# EAGLE design Hardware_X_Paper (EAGLE 9.3.0)

## Sheet 1 of 2
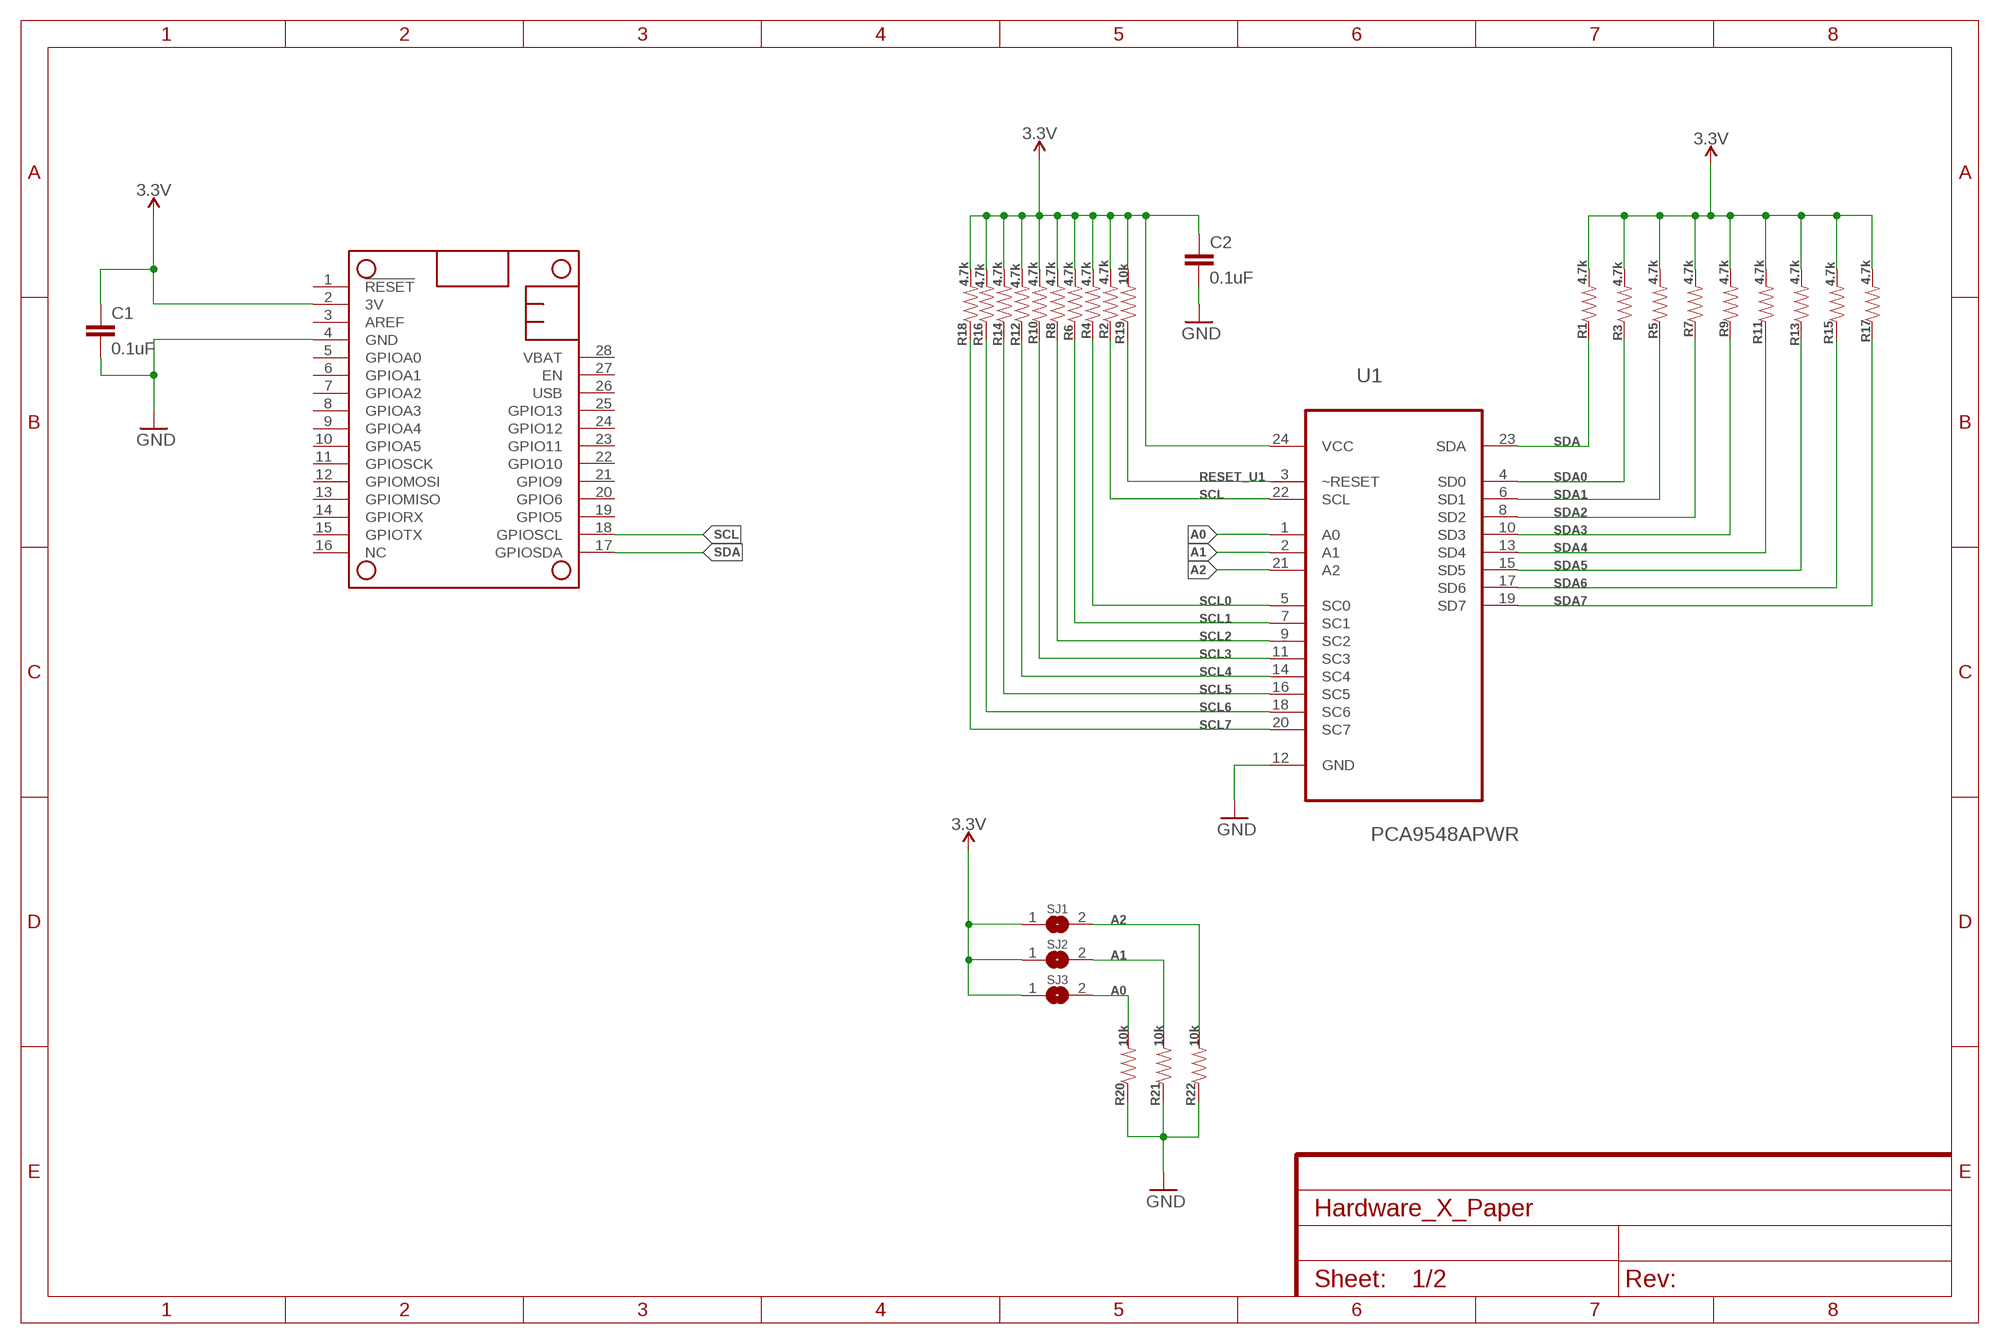
[diagram p0: schematic, sheet 1]

### Parts
C1  0.1uF  0.1UF-0603-25V-(+80/-20%)  [0603]
C2  0.1uF  0.1UF-0603-25V-(+80/-20%)  [0603]
MS1  MICROBUILDER_FEATHERWING_NOHOLES  [MICROBUILDER_FEATHERWING_NOHOLES]
R1  4.7k  4.7KOHM-0603-1/10W-1%  [0603]
R2  4.7k  4.7KOHM-0603-1/10W-1%  [0603]
R3  4.7k  4.7KOHM-0603-1/10W-1%  [0603]
R4  4.7k  4.7KOHM-0603-1/10W-1%  [0603]
R5  4.7k  4.7KOHM-0603-1/10W-1%  [0603]
R6  4.7k  4.7KOHM-0603-1/10W-1%  [0603]
R7  4.7k  4.7KOHM-0603-1/10W-1%  [0603]
R8  4.7k  4.7KOHM-0603-1/10W-1%  [0603]
R9  4.7k  4.7KOHM-0603-1/10W-1%  [0603]
R10  4.7k  4.7KOHM-0603-1/10W-1%  [0603]
R11  4.7k  4.7KOHM-0603-1/10W-1%  [0603]
R12  4.7k  4.7KOHM-0603-1/10W-1%  [0603]
R13  4.7k  4.7KOHM-0603-1/10W-1%  [0603]
R14  4.7k  4.7KOHM-0603-1/10W-1%  [0603]
R15  4.7k  4.7KOHM-0603-1/10W-1%  [0603]
R16  4.7k  4.7KOHM-0603-1/10W-1%  [0603]
R17  4.7k  4.7KOHM-0603-1/10W-1%  [0603]
R18  4.7k  4.7KOHM-0603-1/10W-1%  [0603]
R19  10k  10KOHM-0603-1/10W-1%  [0603]
R20  10k  10KOHM-0603-1/10W-1%  [0603]
R21  10k  10KOHM-0603-1/10W-1%  [0603]
R22  10k  10KOHM-0603-1/10W-1%  [0603]
SJ1  MICROBUILDER_SOLDERJUMPER  [MICROBUILDER_SOLDERJUMPER_ARROW_NOPASTE]
SJ2  MICROBUILDER_SOLDERJUMPER  [MICROBUILDER_SOLDERJUMPER_ARROW_NOPASTE]
SJ3  MICROBUILDER_SOLDERJUMPER  [MICROBUILDER_SOLDERJUMPER_ARROW_NOPASTE]
U1  PCA9548APWR  [SOP65P640X120-24N]

### Nets
3.3V: C1.1 C2.1 MS1.2(3V) R1.2 R2.2 R3.2 R4.2 R5.2 R6.2 R7.2 R8.2 R9.2 R10.2 R11.2 R12.2 R13.2 R14.2 R15.2 R16.2 R17.2 R18.2 R19.2 SJ1.1 SJ2.1 SJ3.1 U1.24(VCC) ; also sheet 2
A0: R20.2 SJ3.2 U1.1(A0)
A1: R21.2 SJ2.2 U1.2(A1)
A2: R22.2 SJ1.2 U1.21(A2)
GND: C1.2 C2.2 MS1.4(GND) R20.1 R21.1 R22.1 U1.12(GND) ; also sheet 2
RESET_U1: R19.1 U1.3(~RESET)
SCL: MS1.18(GPIOSCL) R2.1 U1.22(SCL)
SCL0: R4.1 U1.5(SC0) ; also sheet 2
SCL1: R6.1 U1.7(SC1) ; also sheet 2
SCL2: R8.1 U1.9(SC2) ; also sheet 2
SCL3: R10.1 U1.11(SC3) ; also sheet 2
SCL4: R12.1 U1.14(SC4) ; also sheet 2
SCL5: R14.1 U1.16(SC5) ; also sheet 2
SCL6: R16.1 U1.18(SC6) ; also sheet 2
SCL7: R18.1 U1.20(SC7) ; also sheet 2
SDA: MS1.17(GPIOSDA) R1.1 U1.23(SDA)
SDA0: R3.1 U1.4(SD0) ; also sheet 2
SDA1: R5.1 U1.6(SD1) ; also sheet 2
SDA2: R7.1 U1.8(SD2) ; also sheet 2
SDA3: R9.1 U1.10(SD3) ; also sheet 2
SDA4: R11.1 U1.13(SD4) ; also sheet 2
SDA5: R13.1 U1.15(SD5) ; also sheet 2
SDA6: R15.1 U1.17(SD6) ; also sheet 2
SDA7: R17.1 U1.19(SD7) ; also sheet 2
Unconnected: MS1.1(!RESET) MS1.3(AREF) MS1.5(GPIOA0) MS1.6(GPIOA1) MS1.7(GPIOA2) MS1.8(GPIOA3) MS1.9(GPIOA4) MS1.10(GPIOA5) MS1.11(GPIOSCK) MS1.12(GPIOMOSI) MS1.13(GPIOMISO) MS1.14(GPIORX) MS1.15(GPIOTX) MS1.16(NC) MS1.19(GPIO5) MS1.20(GPIO6) MS1.21(GPIO9) MS1.22(GPIO10) MS1.23(GPIO11) MS1.24(GPIO12) MS1.25(GPIO13) MS1.26(USB) MS1.27(EN) MS1.28(VBAT)

## Sheet 2 of 2
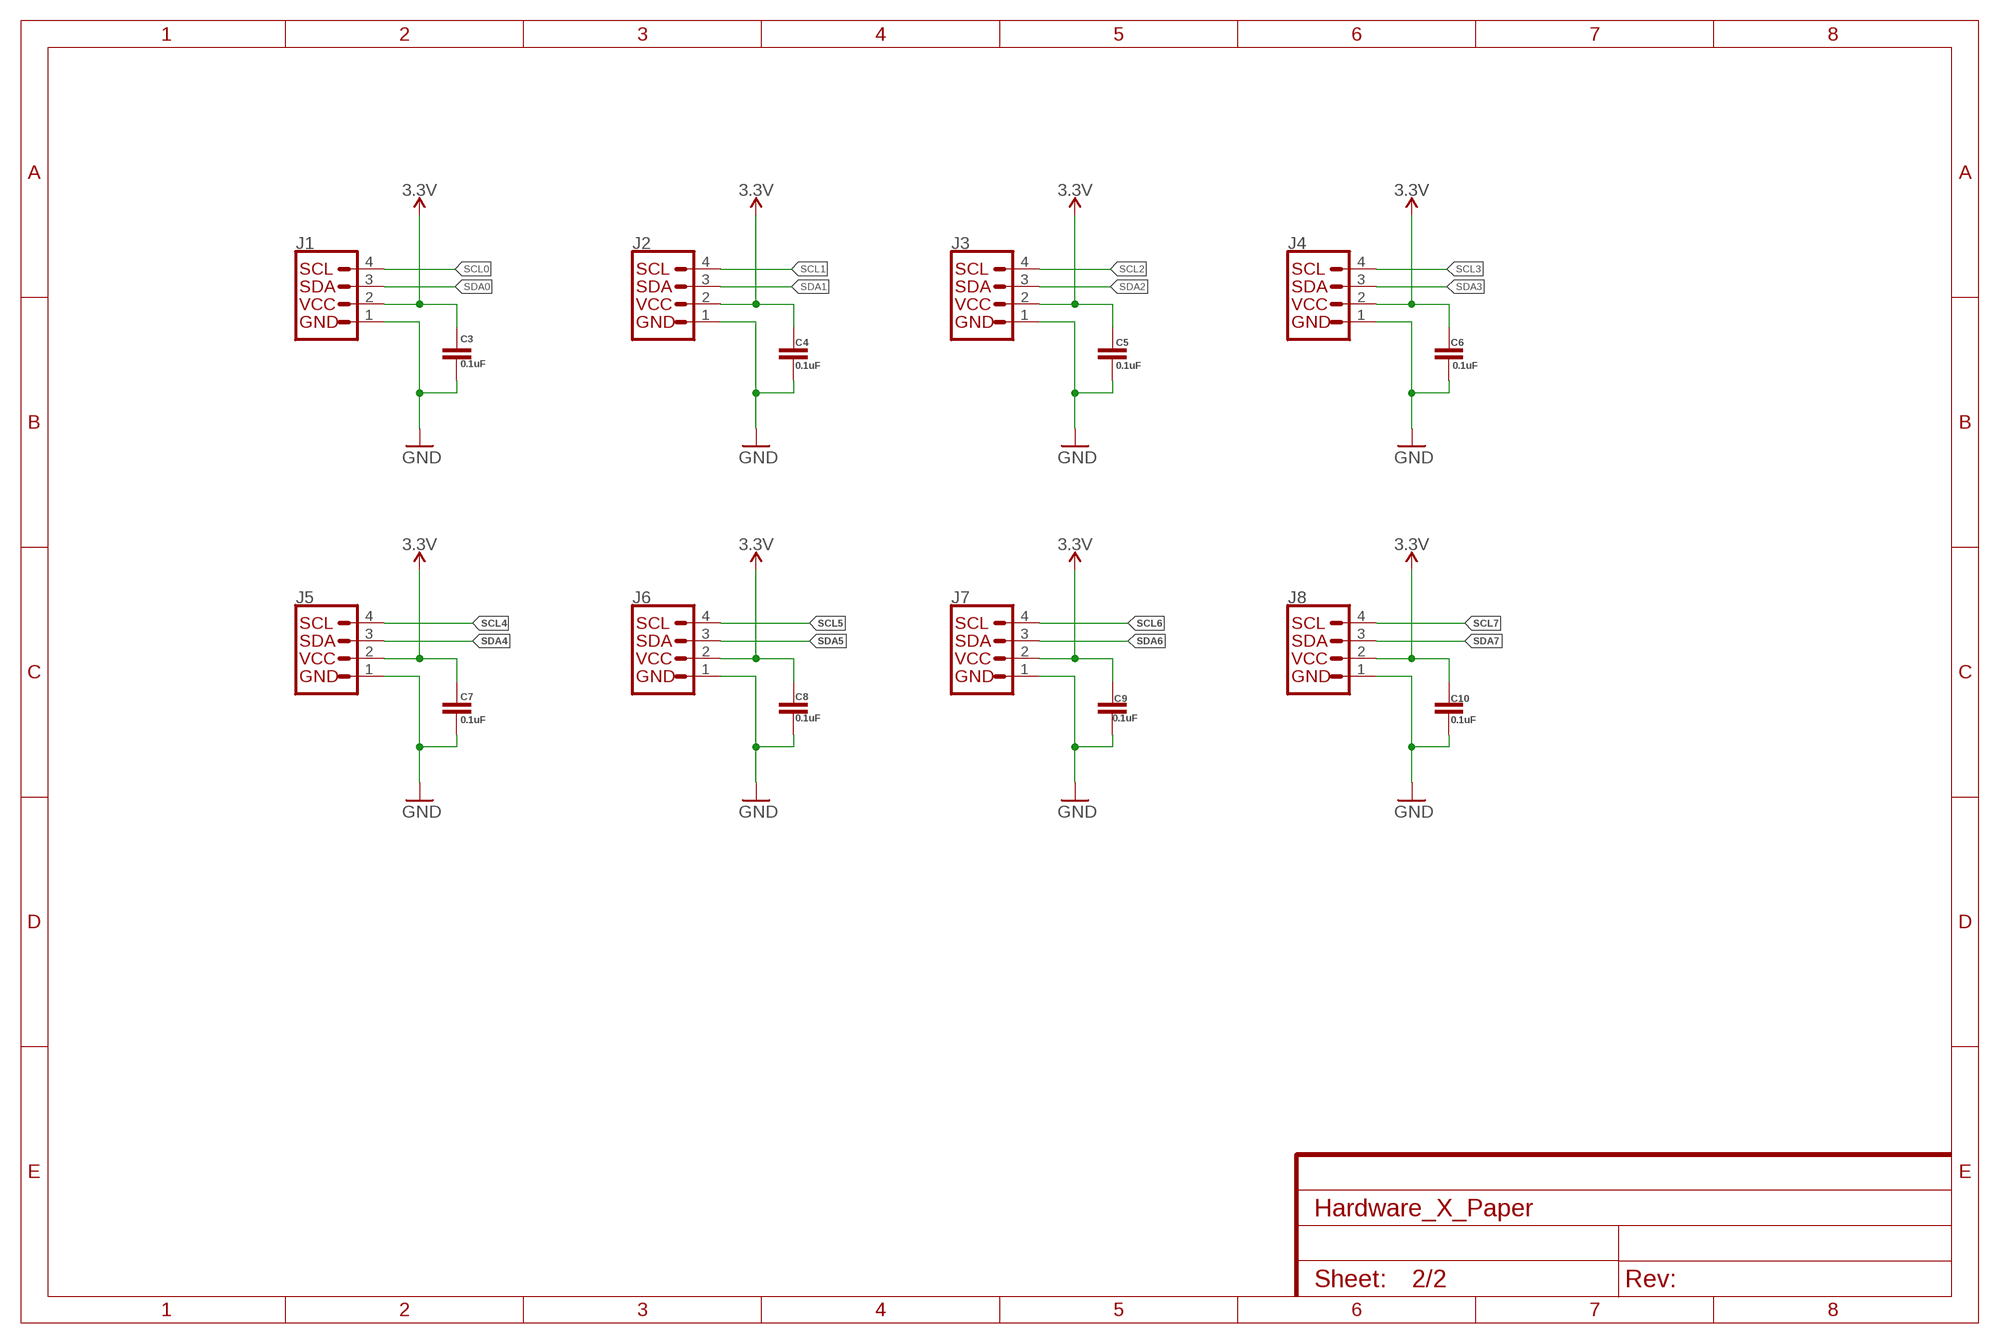
[diagram p1: schematic, sheet 2]

### Parts
C3  0.1uF  0.1UF-0603-25V-(+80/-20%)  [0603]
C4  0.1uF  0.1UF-0603-25V-(+80/-20%)  [0603]
C5  0.1uF  0.1UF-0603-25V-(+80/-20%)  [0603]
C6  0.1uF  0.1UF-0603-25V-(+80/-20%)  [0603]
C7  0.1uF  0.1UF-0603-25V-(+80/-20%)  [0603]
C8  0.1uF  0.1UF-0603-25V-(+80/-20%)  [0603]
C9  0.1uF  0.1UF-0603-25V-(+80/-20%)  [0603]
C10  0.1uF  0.1UF-0603-25V-(+80/-20%)  [0603]
J1  QWIIC_CONNECTORJS-1MM  [1X04_1MM_RA]
J2  QWIIC_CONNECTORJS-1MM  [1X04_1MM_RA]
J3  QWIIC_CONNECTORJS-1MM  [1X04_1MM_RA]
J4  QWIIC_CONNECTORJS-1MM  [1X04_1MM_RA]
J5  QWIIC_CONNECTORJS-1MM  [1X04_1MM_RA]
J6  QWIIC_CONNECTORJS-1MM  [1X04_1MM_RA]
J7  QWIIC_CONNECTORJS-1MM  [1X04_1MM_RA]
J8  QWIIC_CONNECTORJS-1MM  [1X04_1MM_RA]

### Nets
3.3V: C3.1 C4.1 C5.1 C6.1 C7.1 C8.1 C9.1 C10.1 J1.2(VCC) J2.2(VCC) J3.2(VCC) J4.2(VCC) J5.2(VCC) J6.2(VCC) J7.2(VCC) J8.2(VCC) ; also sheet 1
GND: C3.2 C4.2 C5.2 C6.2 C7.2 C8.2 C9.2 C10.2 J1.1(GND) J2.1(GND) J3.1(GND) J4.1(GND) J5.1(GND) J6.1(GND) J7.1(GND) J8.1(GND) ; also sheet 1
SCL0: J1.4(SCL) ; also sheet 1
SCL1: J2.4(SCL) ; also sheet 1
SCL2: J3.4(SCL) ; also sheet 1
SCL3: J4.4(SCL) ; also sheet 1
SCL4: J5.4(SCL) ; also sheet 1
SCL5: J6.4(SCL) ; also sheet 1
SCL6: J7.4(SCL) ; also sheet 1
SCL7: J8.4(SCL) ; also sheet 1
SDA0: J1.3(SDA) ; also sheet 1
SDA1: J2.3(SDA) ; also sheet 1
SDA2: J3.3(SDA) ; also sheet 1
SDA3: J4.3(SDA) ; also sheet 1
SDA4: J5.3(SDA) ; also sheet 1
SDA5: J6.3(SDA) ; also sheet 1
SDA6: J7.3(SDA) ; also sheet 1
SDA7: J8.3(SDA) ; also sheet 1

## Library data of the parts
C1-C10 = SparkFun-Capacitors:0.1UF: 0.1µF ceramic capacitors A capacitor is a passive two-terminal electrical component used to store electrical energy temporarily in an electric field.; PROD_ID: CAP-00810
J1-J8 = SparkFun-Connectors:QWIIC_CONNECTOR: SparkFun I2C Standard Qwiic Connector An SMD 1mm pitch JST connector makes it easy and quick (get it? Qwiic?) to connect I2C devices to each other. The Qwiic system <http://www.sparkfun.com/qwiic> enables fast and solderless connection between popular platforms and various sensors and actuators. We carry 200mm <https://www.sparkfun.com/products/14204>, 100mm <https://www.sparkfun.com/products/14205>, 50mm <https://www.sparkfun.com/products/14206>, and breadboard friendly <https://www.sparkfun.com/products/14207> Qwiic cables. We also offer 10 pcs strips <https://www.sparkfun.com/products/14323> the SMD connectors.
MS1 = Adafruit Crickit FeatherWing:MICROBUILDER_FEATHERWING
R1-R18 = SparkFun-Resistors:4.7KOHM: 4.7kΩ resistor A resistor is a passive two-terminal electrical component that implements electrical resistance as a circuit element. Resistors act to reduce current flow, and, at the same time, act to lower voltage levels within circuits. - Wikipedia; PROD_ID: RES-07857
R19-R22 = SparkFun-Resistors:10KOHM: 10kΩ resistor A resistor is a passive two-terminal electrical component that implements electrical resistance as a circuit element. Resistors act to reduce current flow, and, at the same time, act to lower voltage levels within circuits. - Wikipedia; PROD_ID: RES-00824
SJ1-SJ3 = Adafruit Crickit FeatherWing:MICROBUILDER_SOLDERJUMPER: SMD Solder JUMPER Solder the two pads together to create a connection, or remove the solder to break it. REFLOW - Use this footprint for solder paste and reflow ovens. WAVE - Use this footprint for hand-soldering (larger pads). CLOSED - Has a trace between the two pads to ensure it is closed by default. The trace needs to be cut to disable the jumper, and can be closed again by creating a solder bridge between the two pads.; BOM: EXCLUDE
U1 = PCA9548APWR:PCA9548APWR: 8-CHANNEL I2C SWITCH WITH RESET; AVAILABILITY: Unavailable; DESCRIPTION: 8-Channel I2C Switch With Reset 24-TSSOP -40 to 85; MF: Texas Instruments; MP: PCA9548APWR; PACKAGE: TSSOP-24 Texas Instruments; PRICE: None

## Board
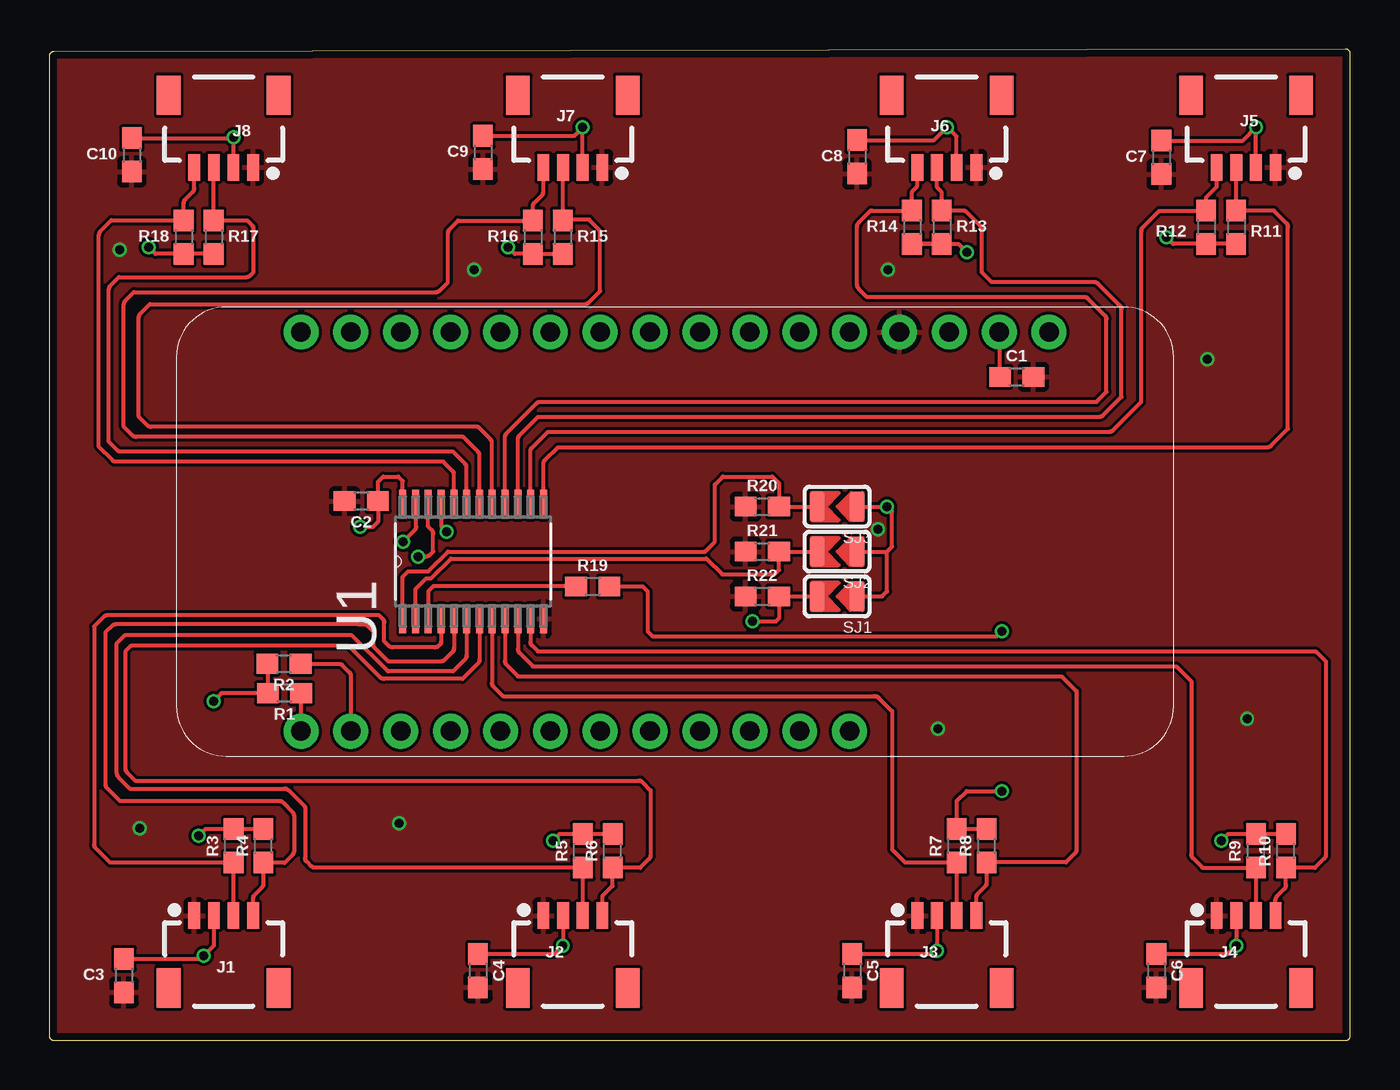
[diagram p2: board, top side]
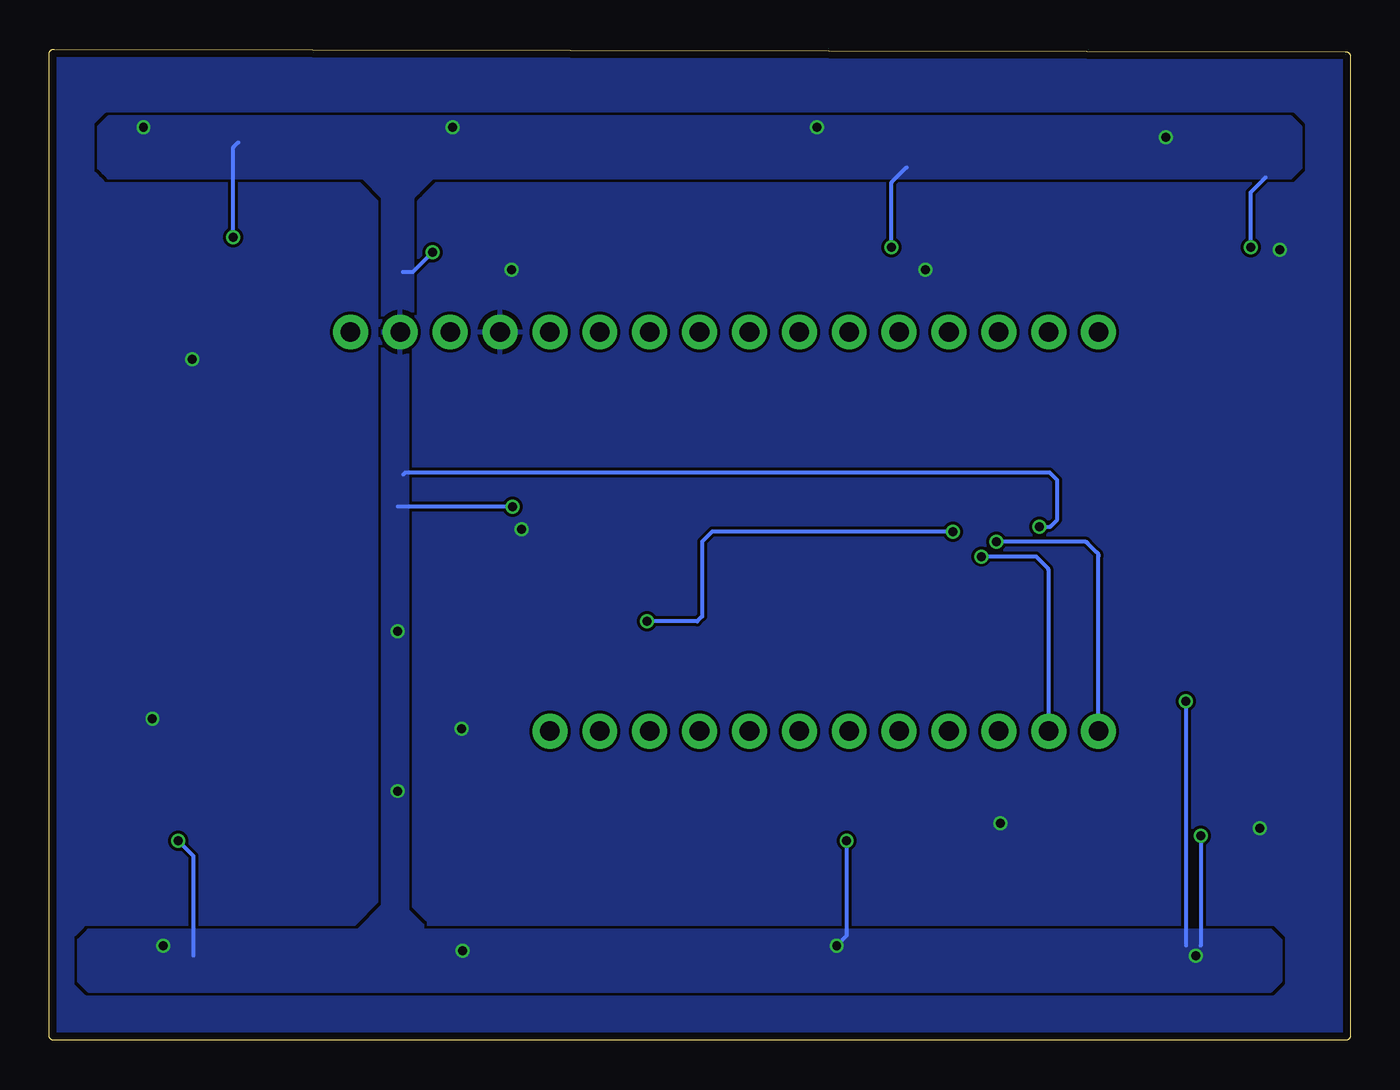
[diagram p3: board, bottom side, seen from below]

Size 66.27 x 50.47 mm. Coordinates in mm from the lower left corner, seen from the top.
Outline: 66.27,0.25 66.27,50.22 arc90 66.02,50.47 0.25,50.34 arc90 0,50.09 0,0.25 arc90 0.25,0 66.02,0 arc90 66.27,0.25
Copper layers (1*16): Top 0.035559375mm / dielectric 1.6mm / Bottom 0.035559375mm
Design rules "oshpark-2layer": minimum track width 6mil, minimum drill 10mil, track to track 6mil, track to pad 6mil, pad to pad 6mil, via to via 6mil, smd to smd 6mil, copper to edge 15mil, drill to drill 6mil, minimum pad ring 5mil, minimum via ring 5mil, stop-mask expansion 2.5mil, vias tented up to drill 0mil, thermal gap 10mil

### Footprints (pad centres in the part's own frame; a part is rotated, then mirrored left to right if it is on the bottom)
0603 = smd 1.1 x 1: 1 -0.85,0; 2 0.85,0
1X04_1MM_RA = smd 0.6 x 1.35: 1 -1.5,0; 2 -0.5,0; 3 0.5,0; 4 1.5,0 | smd 1.2 x 2: NC1 2.8,-3.675; NC2 -2.8,-3.675
MICROBUILDER_FEATHERWING_NOHOLES = drill 1 pad 1.778: 1 6.35,1.27; 2 8.89,1.27; 3 11.43,1.27; 4 13.97,1.27; 5 16.51,1.27; 6 19.05,1.27; 7 21.59,1.27; 8 24.13,1.27; 9 26.67,1.27; 10 29.21,1.27; 11 31.75,1.27; 12 34.29,1.27; 13 36.83,1.27; 14 39.37,1.27; 15 41.91,1.27; 16 44.45,1.27; 17 44.45,21.59; 18 41.91,21.59; 19 39.37,21.59; 20 36.83,21.59; 21 34.29,21.59; 22 31.75,21.59; 23 29.21,21.59; 24 26.67,21.59; 25 24.13,21.59; 26 21.59,21.59; 27 19.05,21.59; 28 16.51,21.59
MICROBUILDER_SOLDERJUMPER_ARROW_NOPASTE = smd 0.762 x 1.524: 1 -1.016,0; 2 1.016,0
SOP65P640X120-24N = smd 1.473 x 0.356: 1 -2.921,3.581; 2 -2.921,2.921; 3 -2.921,2.286; 4 -2.921,1.626; 5 -2.921,0.965; 6 -2.921,0.33; 7 -2.921,-0.33; 8 -2.921,-0.965; 9 -2.921,-1.626; 10 -2.921,-2.286; 11 -2.921,-2.921; 12 -2.921,-3.581; 13 2.921,-3.581; 14 2.921,-2.921; 15 2.921,-2.286; 16 2.921,-1.626; 17 2.921,-0.965; 18 2.921,-0.33; 19 2.921,0.33; 20 2.921,0.965; 21 2.921,1.626; 22 2.921,2.286; 23 2.921,2.921; 24 2.921,3.581

### Placement (x,y rotation side)
C1  49.28,33.78 0 top
C2  15.9,27.46 180 top
C3  3.81,3.3 270 top
C4  21.84,3.56 270 top
C5  40.89,3.56 270 top
C6  56.39,3.56 270 top
C7  56.64,44.96 270 top
C8  41.15,44.98 270 top
C9  22.1,45.21 270 top
C10  4.22,45.09 270 top
J1  8.89,6.35 0 top
J2  26.67,6.35 0 top
J3  45.72,6.35 0 top
J4  60.96,6.35 0 top
J5  60.96,44.45 180 top
J6  45.72,44.45 180 top
J7  26.67,44.45 180 top
J8  8.89,44.45 180 top
MS1  57.28,37.34 180 top
R1  11.99,17.68 180 top
R2  11.96,19.18 180 top
R3  9.4,9.91 90 top
R4  10.92,9.91 90 top
R5  27.18,9.65 90 top
R6  28.7,9.65 90 top
R7  46.23,9.91 90 top
R8  47.75,9.91 90 top
R9  61.47,9.65 90 top
R10  62.99,9.65 90 top
R11  60.45,41.4 270 top
R12  58.93,41.4 270 top
R13  45.47,41.4 270 top
R14  43.94,41.4 270 top
R15  26.16,40.89 270 top
R16  24.64,40.89 270 top
R17  8.38,40.89 270 top
R18  6.86,40.89 270 top
R19  27.69,23.11 0 top
R20  36.32,27.18 0 top
R21  36.32,24.89 0 top
R22  36.32,22.61 0 top
SJ1  40.13,22.61 180 top
SJ2  40.13,24.89 180 top
SJ3  40.13,27.18 180 top
U1  21.59,24.38 90 top

### Tracks (layer width: path | path; a pad name or v marks a point on that pad's centre or on a via)
3.3V  (via drill 0.46)
  Top 0.203: C1.1 48.43,36.03 MS1.2 | J8.2 9.39,45.92 | 9.39,45.92 v9.39,45.97 v9.4,45.97 9.65,45.97 | C10.1 9.38,45.94 9.39,45.92 | C9.1 26.76,46.06 v27.18,46.48 v27.17,46.47 J7.2 | J6.2 46.22,46.03 45.77,46.48 v45.72,46.48 45.07,45.83 C8.1 | C7.1 60.79,45.81 v61.47,46.48 v61.46,46.47 J5.2 | R13.2 R14.2 46.32,40.55 v46.74,40.13 | R15.2 R16.2 23.71,40.04 v23.37,40.39 | J1.2 8.39,4.83 v7.87,4.32 7.71,4.15 C3.1 | C4.1 25.74,4.41 v26.16,4.83 v26.17,4.83 J2.2 | C5.1 45.05,4.41 v45.21,4.57 v45.22,4.58 J3.2 | R8.2 R7.2 46.23,12.19 46.74,12.7 v48.51,12.7 | C6.1 60.03,4.41 v60.45,4.83 v60.46,4.83 J4.2 | R10.2 R9.2 60.03,10.5 v59.69,10.16 | SJ3.1 v42.67,27.18 42.93,26.92 42.93,25.15 42.67,24.89 | R17.2 R18.2 5.42,40.04 v5.08,40.39 | SJ2.1 42.67,24.89 | SJ1.1 42.42,22.61 42.67,22.86 42.67,24.89 | U1.24 18.01,28.47 17.78,28.7 17.02,28.7 16.75,28.43 C2.1 16.75,26.4 16.48,26.14 15.88,26.14 v15.85,26.16 | R4.2 R3.2 7.96,10.76 v7.62,10.41 | R2.2 11.14,19.15 R1.2 8.79,17.68 v8.38,17.27 | R6.2 R5.2 26,10.5 v25.65,10.16 | R19.2 30.23,23.11 30.48,22.86 30.48,20.83 30.73,20.57 48.26,20.57 v48.51,20.83 | R11.2 R12.2 57.24,40.55 v56.9,40.89
  Bottom 0.203: v46.74,40.13 47.75,39.12 48.26,39.12 | v23.37,40.39 23.37,43.69 22.61,44.45 | v59.69,10.16 58.93,9.4 58.93,4.32 | v42.67,27.18 48.51,27.18 | v15.85,26.16 15.29,26.16 14.94,26.52 14.94,28.52 15.32,28.91 48.13,28.91 48.23,28.8 | v7.62,10.41 7.62,4.83 | v8.38,17.27 8.38,4.83 | v25.65,10.16 25.65,5.33 v26.16,4.83 | v5.08,40.39 5.08,43.18 4.32,43.94 | v56.9,40.89 56.9,45.47 56.64,45.72
  pour Bottom: 3.05,46.99 63.25,46.99 63.75,46.48 63.75,45.47 63.75,44.45 63.5,44.2 63.25,43.94 60.71,43.94 3.05,43.94 2.79,44.2 2.54,44.45 2.54,45.21 2.54,46.48
  pour Bottom: 4.06,5.59 64.26,5.59 64.77,5.08 64.77,4.06 64.77,3.05 64.52,2.79 64.26,2.54 61.72,2.54 4.06,2.54 3.81,2.79 3.56,3.05 3.56,3.81 3.56,5.08
  pour Bottom: 47.75,36.07 47.75,42.93 47.5,43.18 46.48,44.2 46.48,44.7 46.48,44.96 46.99,45.47 47.24,45.72 49.28,45.72 49.78,45.21 50.29,44.7 50.29,43.94 49.28,42.93 49.28,36.32 49.28,6.86 50.55,5.59 50.55,4.83 50.55,4.57 50.04,4.06 48.26,4.06 47.75,4.06 47.24,4.57 47.24,5.84 48.01,6.6 48.01,35.81
A0
  Top 0.203: SJ3.2 R20.2 37.17,28.36 36.83,28.7 34.31,28.7 33.91,28.3 33.91,25.4 33.4,24.89 20.32,24.89 19.3,23.88 18.29,23.88 18.01,23.6 U1.1
A1
  Top 0.203: SJ2.2 R21.2 37.17,23.96 36.93,23.72 34.29,23.72 33.48,24.54 20.47,24.54 19.45,23.52 19.2,23.52 18.67,22.99 U1.2
A2  (via drill 0.46)
  Top 0.203: SJ1.2 R22.2 37.19,22.59 37.19,21.51 37.01,21.34 v35.81,21.34 | U1.21 19.96,26.19 v20.24,25.91
  Bottom 0.203: v20.24,25.91 32.51,25.91 33.02,25.4 33.02,21.59 33.27,21.34 v35.81,21.34
GND  (via drill 0.46)
  other vias: 42.21,26.04 4.62,10.79 17.83,11.05 45.26,15.88 61.01,16.38 58.98,34.67 42.72,39.24 21.64,39.24 3.61,40.26
  pour Top (rank 6): 0,-0.25 66.04,-0.25 arc90 66.29,0 66.29,50.29 0.25,50.29 arc90 0,50.04
  pour Bottom (rank 6): 0,0 66.04,0 arc90 66.29,0.25 66.29,50.29 0.25,50.29 arc90 0,50.04
RESET_U1
  Top 0.203: U1.3 19.3,22.86 19.56,23.11 R19.1
SCL  (via drill 0.46)
  Top 0.203: R2.1 14.75,19.18 arc-45 14.93,19.1 15.29,18.74 arc-45 15.37,18.56 MS1.18 | v18.8,24.64 19.2,24.64 arc45 19.38,24.71 19.56,24.89 19.56,25.8 arc45 19.48,25.98 19.3,26.16 U1.22
  Bottom 0.203: MS1.18 15.37,23.9 arc-45 15.44,24.08 16,24.64 v18.8,24.64
SCL0
  Top 0.203: J1.4 10.39,7.24 arc-45 10.46,7.42 10.85,7.8 arc45 10.92,7.98 R4.1 arc45 10.96,9.04 11.99,9.04 12.4,9.45 arc45 12.47,9.63 12.47,11.45 arc45 12.4,11.63 11.91,12.12 arc45 11.73,12.19 3.61,12.19 2.94,12.85 arc-45 2.87,13.03 2.87,20.78 3.2,21.11 arc-45 3.38,21.18 15.75,21.18 15.79,21.18 16.05,21.18 arc-45 16.23,21.11 16.51,20.83 16.51,20.07 17.27,19.3 19.96,19.3 arc45 20.14,19.38 20.55,19.79 arc45 20.62,19.97 U1.5
SCL1
  Top 0.203: J2.4 arc45 28.19,6.41 28.19,7.37 28.7,7.87 28.7,8.76 | 28.7,8.76 R6.1 | U1.7 21.92,19.38 arc-45 21.85,19.2 21.06,18.41 17.05,18.41 arc-45 16.87,18.49 15.27,20.09 4.17,20.09 3.89,19.81 3.89,13.85 arc45 3.96,13.67 4.39,13.23 30.02,13.23 arc-45 30.2,13.16 30.63,12.72 30.63,9.43 arc-45 30.56,9.25 30.1,8.79 28.76,8.79 arc45 28.7,8.76
SCL2
  Top 0.203: J3.4 47.22,7.29 arc-45 47.29,7.47 47.68,7.85 arc45 47.75,8.03 R8.1 arc-45 47.78,9.07 51.79,9.07 52.25,9.53 arc45 52.32,9.71 52.32,17.78 51.64,18.47 arc45 51.46,18.54 23.88,18.54 23.29,19.13 arc-45 23.22,19.31 U1.9
SCL3
  Top 0.203: U1.11 24.51,20.3 arc45 24.59,20.12 24.89,19.81 64.41,19.81 arc-45 64.59,19.74 65.02,19.3 65.02,9.45 arc-45 64.95,9.27 64.47,8.79 63.02,8.79 arc-45 R10.1 62.99,7.9 arc-45 62.92,7.72 62.53,7.34 arc45 62.46,7.16 J4.4
SCL4
  Top 0.203: U1.14 24.51,29.99 arc-45 24.59,30.17 25.4,30.99 54,30.99 arc45 54.18,31.06 55.63,32.51 55.63,41.22 arc-45 55.7,41.4 56.54,42.24 58.9,42.24 arc45 R12.1 58.93,42.93 59.46,43.46 J5.4
SCL5
  Top 0.203: U1.16 23.22,30.73 arc-45 23.29,30.91 24.82,32.44 arc-45 25,32.51 53.34,32.51 53.85,33.02 53.85,36.73 arc45 53.77,36.9 52.91,37.77 arc45 52.73,37.85 41.66,37.85 41.22,38.28 arc-45 41.15,38.46 41.15,41.45 arc-45 41.22,41.63 41.81,42.22 arc-45 41.89,42.25 R14.1 43.94,43.17 arc-45 43.97,43.23 44.15,43.41 arc45 44.22,43.59 J6.4
SCL6
  Top 0.203: U1.18 21.92,29.79 arc45 21.85,29.97 21.08,30.73 4.42,30.73 arc-45 4.24,30.81 3.81,31.24 3.81,37.49 arc-45 3.88,37.67 4.32,38.1 19.71,38.1 arc45 19.89,38.17 20.32,38.61 20.32,41.12 arc-45 20.39,41.3 20.83,41.73 24.61,41.73 arc45 R16.1 24.64,42.47 arc-45 24.71,42.65 25.1,43.03 arc45 25.17,43.21 J7.4
SCL7
  Top 0.203: U1.20 20.62,28.8 arc45 20.55,28.98 20.07,29.46 3.41,29.46 arc-45 3.23,29.54 2.54,30.23 2.54,41.02 arc-45 2.61,41.2 3.17,41.76 6.83,41.76 arc-45 R18.1 6.86,42.64 arc-45 6.93,42.82 7.32,43.21 arc45 7.39,43.38 J8.4
SDA  (via drill 0.46)
  Top 0.152: 12.83,17.67 arc-90 R1.1
  Top 0.203: MS1.17 12.83,17.67 | U1.23 arc-45 18.69,27.24 18.69,26.17 arc-45 18.62,25.99 v18.03,25.4
  Bottom 0.203: MS1.17 12.83,24.66 arc-45 12.9,24.84 13.39,25.33 arc-45 13.57,25.4 v18.03,25.4
SDA0
  Top 0.203: J1.3 arc45 9.4,6.37 R3.1 arc45 9.37,9.07 3.1,9.07 2.36,9.81 arc-45 2.29,9.99 2.29,21.08 2.77,21.57 arc-45 2.95,21.64 16.82,21.64 16.99,21.46 arc-45 17.07,21.28 17.07,20.32 17.3,20.09 arc45 17.48,20.02 19.66,20.02 arc45 19.84,20.09 19.91,20.17 arc45 19.96,20.29 U1.4
SDA1
  Top 0.203: U1.6 21.26,19.59 arc-45 21.18,19.41 20.57,18.8 17.27,18.8 arc-45 17.23,18.81 15.42,20.62 3.86,20.62 3.43,20.19 3.43,13.62 3.45,13.59 arc45 3.53,13.41 4.12,12.83 11.98,12.83 arc-45 12.16,12.75 13.03,11.89 13.03,9.3 arc45 13.11,9.12 13.35,8.88 arc45 13.53,8.8 R5.1 | 26.93,8.66 arc45 27.11,8.74 R5.1 | R5.1 arc45 27.17,8.78 J2.3
SDA2
  Top 0.203: J3.3 arc45 46.23,6.37 R7.1 arc45 46.2,9.07 43.59,9.07 43,9.65 arc-45 42.93,9.83 42.93,16.76 42.24,17.45 arc45 42.06,17.53 23.11,17.53 22.63,18.01 arc-45 22.55,18.19 U1.8
SDA3
  Top 0.203: U1.10 23.88,19.92 arc45 23.95,19.74 24.64,19.05 57.3,19.05 arc-45 57.48,18.98 58.17,18.29 58.17,9.48 arc45 58.24,9.3 58.73,8.81 arc45 58.75,8.8 R9.1 61.47,6.37 arc-45 J4.3
SDA4
  Top 0.203: U1.13 25.17,29.36 arc-45 25.25,29.54 25.91,30.2 62.05,30.2 arc45 62.23,30.27 63.09,31.14 63.09,41.42 arc45 63.02,41.6 62.38,42.24 arc45 62.35,42.25 R11.1 J5.3
SDA5
  Top 0.203: U1.15 23.88,30.63 arc-45 23.95,30.81 24.89,31.75 53.49,31.75 arc45 53.67,31.82 54.61,32.77 54.61,37.23 arc45 54.54,37.41 53.41,38.53 arc45 53.23,38.61 48.01,38.61 47.5,39.12 47.5,41.3 arc45 47.42,41.48 46.72,42.18 arc45 46.54,42.25 R13.1 45.47,43.18 45.22,43.43 J6.3
SDA6
  Top 0.203: U1.17 22.55,30.43 arc45 22.48,30.61 21.84,31.24 5.18,31.24 arc-45 5.01,31.32 4.57,31.75 4.57,36.83 arc-45 4.65,37.01 5.13,37.49 27.3,37.49 arc45 27.48,37.56 28.07,38.15 28.07,41.12 arc45 27.99,41.3 27.51,41.78 26.26,41.78 arc45 R15.1 arc45 26.17,41.76 J7.3
SDA7
  Top 0.203: U1.19 21.26,29.18 arc45 21.18,29.36 20.57,29.97 3.66,29.97 arc-45 3.48,30.05 3.05,30.48 3.05,38.25 arc-45 3.12,38.43 3.56,38.86 10.05,38.86 arc45 10.23,38.94 10.41,39.12 10.41,41.32 arc45 10.34,41.5 10.13,41.71 arc45 10.04,41.74 R17.1 arc45 8.39,41.76 J8.3